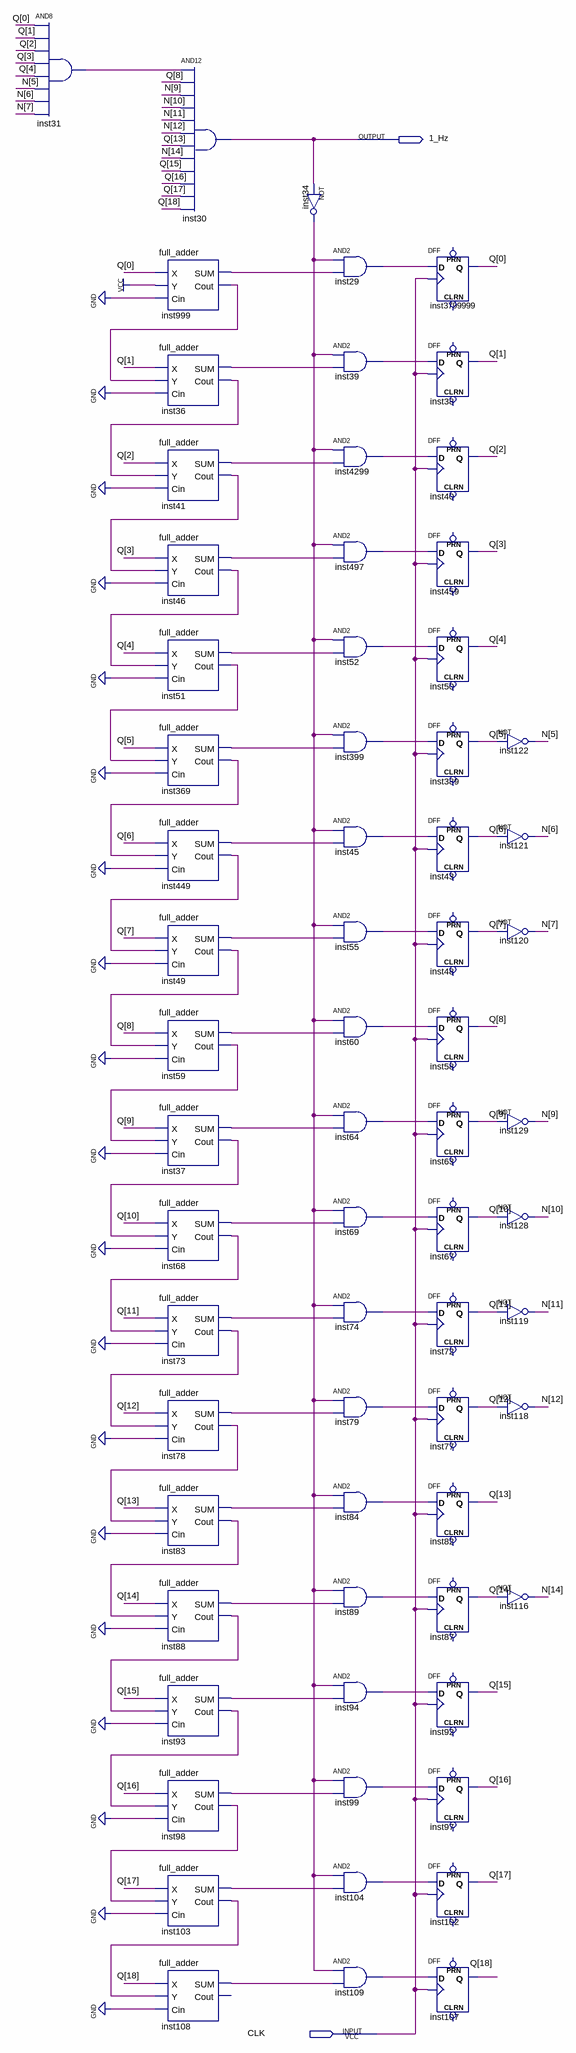
[diagram p0: schematic sheet]
// Quartus schematic one_hertz_clock.bdf as structural Verilog: 68 symbols, 2 pins
module one_hertz_clock (
  input  CLK,
  output \1_Hz 
);

  wire inst29_out, inst31_out, inst34_out, inst36_cout, inst36_sum, inst37_cout, inst37_sum, inst39_out,
       inst41_cout, inst41_sum, inst45_out, inst46_cout, inst46_sum, inst49_cout, inst49_sum, inst51_cout,
       inst51_sum, inst52_out, inst55_out, inst59_cout, inst59_sum, inst60_out, inst64_out, inst68_cout,
       inst68_sum, inst69_out, inst73_cout, inst73_sum, inst74_out, inst78_cout, inst78_sum, inst79_out,
       inst83_cout, inst83_sum, inst84_out, inst88_cout, inst88_sum, inst89_out, inst93_cout, inst93_sum,
       inst94_out, inst98_cout, inst98_sum, inst99_out, inst103_cout, inst103_sum, inst104_out, inst108_sum,
       inst109_out, inst369_cout, inst369_sum, inst399_out, inst449_cout, inst449_sum, inst497_out,
       inst999_cout, inst999_sum, inst4299_out;
  wire [14:5] N;
  wire [18:0] Q;

  and inst31 (inst31_out, Q[0], Q[1], Q[2], Q[3], Q[4], N[5], N[6], N[7]);
  full_adder inst999 (.X(Q[0]), .Y(1'b1), .Cin(1'b0), .SUM(inst999_sum), .Cout(inst999_cout));
  full_adder inst36 (.X(Q[1]), .Y(inst999_cout), .Cin(1'b0), .SUM(inst36_sum), .Cout(inst36_cout));
  full_adder inst41 (.X(Q[2]), .Y(inst36_cout), .Cin(1'b0), .SUM(inst41_sum), .Cout(inst41_cout));
  full_adder inst46 (.X(Q[3]), .Y(inst41_cout), .Cin(1'b0), .SUM(inst46_sum), .Cout(inst46_cout));
  full_adder inst51 (.X(Q[4]), .Y(inst46_cout), .Cin(1'b0), .SUM(inst51_sum), .Cout(inst51_cout));
  full_adder inst369 (.X(Q[5]), .Y(inst51_cout), .Cin(1'b0), .SUM(inst369_sum), .Cout(inst369_cout));
  full_adder inst449 (.X(Q[6]), .Y(inst369_cout), .Cin(1'b0), .SUM(inst449_sum), .Cout(inst449_cout));
  full_adder inst49 (.X(Q[7]), .Y(inst449_cout), .Cin(1'b0), .SUM(inst49_sum), .Cout(inst49_cout));
  full_adder inst59 (.X(Q[8]), .Y(inst49_cout), .Cin(1'b0), .SUM(inst59_sum), .Cout(inst59_cout));
  full_adder inst37 (.X(Q[9]), .Y(inst59_cout), .Cin(1'b0), .SUM(inst37_sum), .Cout(inst37_cout));
  full_adder inst68 (.X(Q[10]), .Y(inst37_cout), .Cin(1'b0), .SUM(inst68_sum), .Cout(inst68_cout));
  full_adder inst73 (.X(Q[11]), .Y(inst68_cout), .Cin(1'b0), .SUM(inst73_sum), .Cout(inst73_cout));
  full_adder inst78 (.X(Q[12]), .Y(inst73_cout), .Cin(1'b0), .SUM(inst78_sum), .Cout(inst78_cout));
  full_adder inst83 (.X(Q[13]), .Y(inst78_cout), .Cin(1'b0), .SUM(inst83_sum), .Cout(inst83_cout));
  full_adder inst88 (.X(Q[14]), .Y(inst83_cout), .Cin(1'b0), .SUM(inst88_sum), .Cout(inst88_cout));
  full_adder inst93 (.X(Q[15]), .Y(inst88_cout), .Cin(1'b0), .SUM(inst93_sum), .Cout(inst93_cout));
  full_adder inst98 (.X(Q[16]), .Y(inst93_cout), .Cin(1'b0), .SUM(inst98_sum), .Cout(inst98_cout));
  full_adder inst103 (.X(Q[17]), .Y(inst98_cout), .Cin(1'b0), .SUM(inst103_sum), .Cout(inst103_cout));
  full_adder inst108 (.X(Q[18]), .Y(inst103_cout), .Cin(1'b0), .SUM(inst108_sum));  // open: Cout
  and inst30 (\1_Hz , inst31_out, Q[8], N[9], N[10], N[11], N[12], Q[13], N[14], Q[15], Q[16], Q[17], Q[18]);
  not inst34 (inst34_out, \1_Hz );
  and inst29 (inst29_out, inst34_out, inst999_sum);
  and inst39 (inst39_out, inst34_out, inst36_sum);
  and inst4299 (inst4299_out, inst34_out, inst41_sum);
  and inst497 (inst497_out, inst34_out, inst46_sum);
  and inst52 (inst52_out, inst34_out, inst51_sum);
  and inst399 (inst399_out, inst34_out, inst369_sum);
  and inst45 (inst45_out, inst34_out, inst449_sum);
  and inst55 (inst55_out, inst34_out, inst49_sum);
  and inst60 (inst60_out, inst34_out, inst59_sum);
  and inst64 (inst64_out, inst34_out, inst37_sum);
  and inst69 (inst69_out, inst34_out, inst68_sum);
  and inst74 (inst74_out, inst34_out, inst73_sum);
  and inst79 (inst79_out, inst34_out, inst78_sum);
  and inst84 (inst84_out, inst34_out, inst83_sum);
  and inst89 (inst89_out, inst34_out, inst88_sum);
  and inst94 (inst94_out, inst34_out, inst93_sum);
  and inst99 (inst99_out, inst34_out, inst98_sum);
  and inst104 (inst104_out, inst34_out, inst103_sum);
  and inst109 (inst109_out, inst34_out, inst108_sum);
  DFF inst3799999 (.CLK(CLK), .D(inst29_out), .Q(Q[0]));  // open: CLRN, PRN
  DFF inst38 (.CLK(CLK), .D(inst39_out), .Q(Q[1]));  // open: CLRN, PRN
  DFF inst40 (.CLK(CLK), .D(inst4299_out), .Q(Q[2]));  // open: CLRN, PRN
  DFF inst459 (.CLK(CLK), .D(inst497_out), .Q(Q[3]));  // open: CLRN, PRN
  DFF inst50 (.CLK(CLK), .D(inst52_out), .Q(Q[4]));  // open: CLRN, PRN
  DFF inst389 (.CLK(CLK), .D(inst399_out), .Q(Q[5]));  // open: CLRN, PRN
  DFF inst43 (.CLK(CLK), .D(inst45_out), .Q(Q[6]));  // open: CLRN, PRN
  DFF inst48 (.CLK(CLK), .D(inst55_out), .Q(Q[7]));  // open: CLRN, PRN
  DFF inst58 (.CLK(CLK), .D(inst60_out), .Q(Q[8]));  // open: CLRN, PRN
  DFF inst63 (.CLK(CLK), .D(inst64_out), .Q(Q[9]));  // open: CLRN, PRN
  DFF inst67 (.CLK(CLK), .D(inst69_out), .Q(Q[10]));  // open: CLRN, PRN
  DFF inst72 (.CLK(CLK), .D(inst74_out), .Q(Q[11]));  // open: CLRN, PRN
  DFF inst77 (.CLK(CLK), .D(inst79_out), .Q(Q[12]));  // open: CLRN, PRN
  DFF inst82 (.CLK(CLK), .D(inst84_out), .Q(Q[13]));  // open: CLRN, PRN
  DFF inst87 (.CLK(CLK), .D(inst89_out), .Q(Q[14]));  // open: CLRN, PRN
  DFF inst92 (.CLK(CLK), .D(inst94_out), .Q(Q[15]));  // open: CLRN, PRN
  DFF inst97 (.CLK(CLK), .D(inst99_out), .Q(Q[16]));  // open: CLRN, PRN
  DFF inst102 (.CLK(CLK), .D(inst104_out), .Q(Q[17]));  // open: CLRN, PRN
  DFF inst107 (.CLK(CLK), .D(inst109_out), .Q(Q[18]));  // open: CLRN, PRN
  not inst122 (N[5], Q[5]);
  not inst121 (N[6], Q[6]);
  not inst120 (N[7], Q[7]);
  not inst129 (N[9], Q[9]);
  not inst128 (N[10], Q[10]);
  not inst119 (N[11], Q[11]);
  not inst118 (N[12], Q[12]);
  not inst116 (N[14], Q[14]);
endmodule
